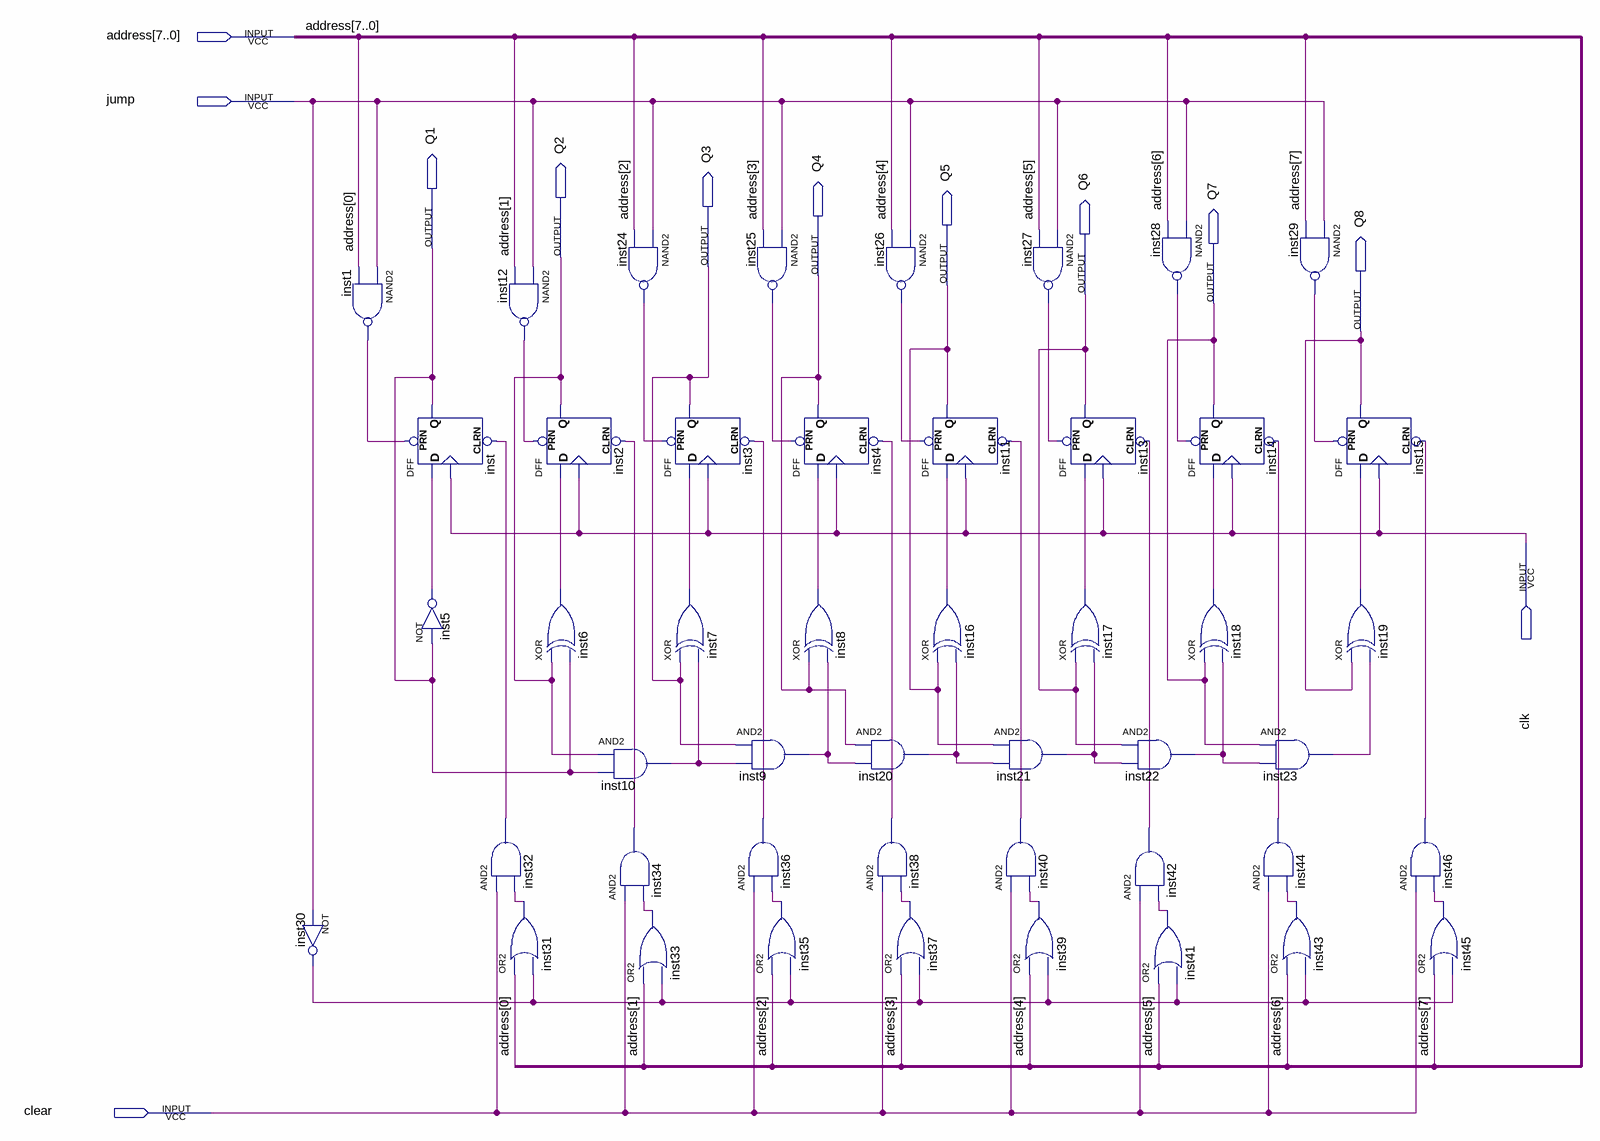
[diagram p0: schematic sheet]
// Quartus schematic clockjump.bdf as structural Verilog: 47 symbols, 12 pins
module clockjump (
  input  [7:0] address,
  input  jump,
  input  clk,
  input  clear,
  output Q1,
  output Q2,
  output Q3,
  output Q4,
  output Q5,
  output Q6,
  output Q7,
  output Q8
);

  wire inst1_out, inst5_out, inst6_out, inst7_out, inst8_out, inst9_out, inst10_out, inst12_out, inst16_out,
       inst17_out, inst18_out, inst19_out, inst20_out, inst21_out, inst22_out, inst23_out, inst24_out,
       inst25_out, inst26_out, inst27_out, inst28_out, inst29_out, inst30_out, inst31_out, inst32_out,
       inst33_out, inst34_out, inst35_out, inst36_out, inst37_out, inst38_out, inst39_out, inst40_out,
       inst41_out, inst42_out, inst43_out, inst44_out, inst45_out, inst46_out;

  nand inst1 (inst1_out, jump, address[0]);
  not inst30 (inst30_out, jump);
  DFF inst (.CLRN(inst32_out), .CLK(clk), .D(inst5_out), .PRN(inst1_out), .Q(Q1));
  not inst5 (inst5_out, Q1);
  and inst32 (inst32_out, clear, inst31_out);
  nand inst12 (inst12_out, jump, address[1]);
  DFF inst2 (.CLRN(inst34_out), .CLK(clk), .D(inst6_out), .PRN(inst12_out), .Q(Q2));
  xor inst6 (inst6_out, Q2, Q1);
  or inst31 (inst31_out, address[0], inst30_out);
  nand inst24 (inst24_out, jump, address[2]);
  and inst10 (inst10_out, Q2, Q1);
  and inst34 (inst34_out, clear, inst33_out);
  or inst33 (inst33_out, address[1], inst30_out);
  DFF inst3 (.CLRN(inst36_out), .CLK(clk), .D(inst7_out), .PRN(inst24_out), .Q(Q3));
  xor inst7 (inst7_out, Q3, inst10_out);
  nand inst25 (inst25_out, jump, address[3]);
  and inst9 (inst9_out, Q3, inst10_out);
  and inst36 (inst36_out, clear, inst35_out);
  or inst35 (inst35_out, address[2], inst30_out);
  DFF inst4 (.CLRN(inst38_out), .CLK(clk), .D(inst8_out), .PRN(inst25_out), .Q(Q4));
  xor inst8 (inst8_out, Q4, inst9_out);
  and inst20 (inst20_out, Q4, inst9_out);
  nand inst26 (inst26_out, jump, address[4]);
  DFF inst11 (.CLRN(inst40_out), .CLK(clk), .D(inst16_out), .PRN(inst26_out), .Q(Q5));
  xor inst16 (inst16_out, Q5, inst20_out);
  and inst38 (inst38_out, clear, inst37_out);
  or inst37 (inst37_out, address[3], inst30_out);
  and inst21 (inst21_out, Q5, inst20_out);
  and inst40 (inst40_out, clear, inst39_out);
  nand inst27 (inst27_out, jump, address[5]);
  DFF inst13 (.CLRN(inst42_out), .CLK(clk), .D(inst17_out), .PRN(inst27_out), .Q(Q6));
  xor inst17 (inst17_out, Q6, inst21_out);
  or inst39 (inst39_out, address[4], inst30_out);
  nand inst28 (inst28_out, jump, address[6]);
  and inst22 (inst22_out, Q6, inst21_out);
  and inst42 (inst42_out, clear, inst41_out);
  or inst41 (inst41_out, address[5], inst30_out);
  DFF inst14 (.CLRN(inst44_out), .CLK(clk), .D(inst18_out), .PRN(inst28_out), .Q(Q7));
  xor inst18 (inst18_out, Q7, inst22_out);
  nand inst29 (inst29_out, jump, address[7]);
  and inst23 (inst23_out, Q7, inst22_out);
  and inst44 (inst44_out, clear, inst43_out);
  or inst43 (inst43_out, address[6], inst30_out);
  DFF inst15 (.CLRN(inst46_out), .CLK(clk), .D(inst19_out), .PRN(inst29_out), .Q(Q8));
  xor inst19 (inst19_out, Q8, inst23_out);
  and inst46 (inst46_out, clear, inst45_out);
  or inst45 (inst45_out, address[7], inst30_out);
endmodule
